# Altium schematic sheet 01_TOP_LEVEL.SchDoc
size A4; SheetNumber: 1; SheetTotal: 4
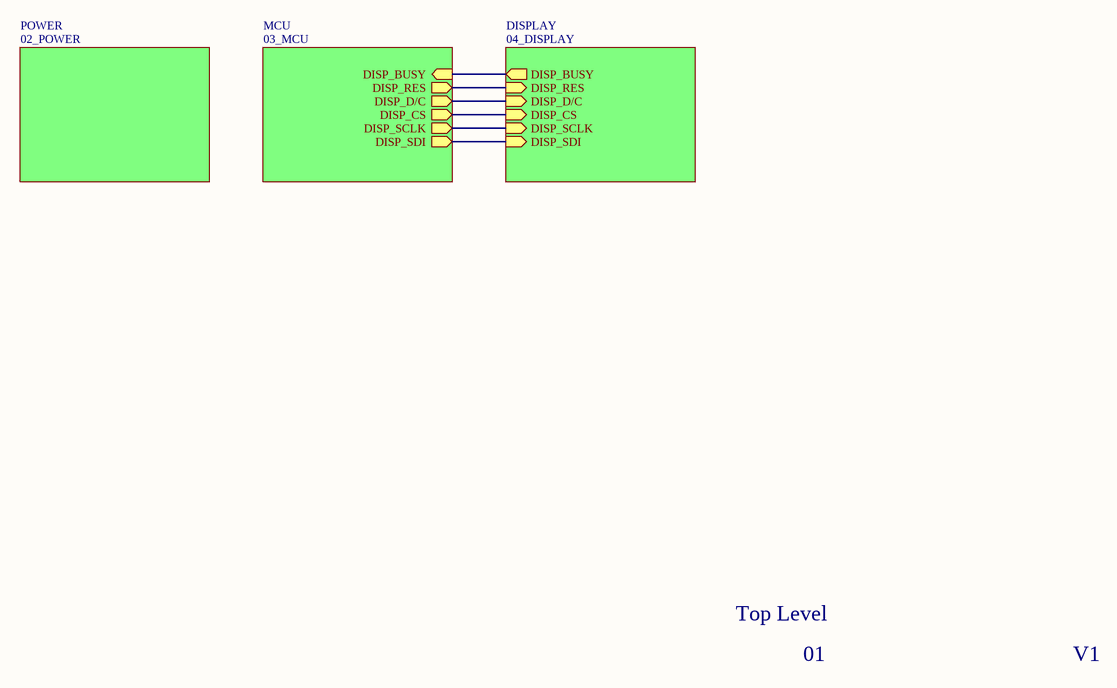
[diagram p0: 01_TOP_LEVEL.SchDoc]

## Sub-sheets
DISPLAY = 04_DISPLAY: DISP_BUSY (out), DISP_RES (in), DISP_D/C (in), DISP_CS (in), DISP_SCLK (in), DISP_SDI (in)
MCU = 03_MCU: DISP_BUSY (in), DISP_RES (out), DISP_D/C (out), DISP_CS (out), DISP_SCLK (out), DISP_SDI (out)
POWER = 02_POWER: no entries

## Nets
(unnamed): sheet MCU/DISP_BUSY, sheet DISPLAY/DISP_BUSY
(unnamed): sheet MCU/DISP_RES, sheet DISPLAY/DISP_RES
(unnamed): sheet MCU/DISP_D/C, sheet DISPLAY/DISP_D/C
(unnamed): sheet MCU/DISP_CS, sheet DISPLAY/DISP_CS
(unnamed): sheet MCU/DISP_SCLK, sheet DISPLAY/DISP_SCLK
(unnamed): sheet MCU/DISP_SDI, sheet DISPLAY/DISP_SDI

## Notes on the sheet
- Top Level
- 01
- V1